# Altium schematic sheet PowerConnections.SchDoc
size A3; SheetNumber: 3; SheetTotal: 3
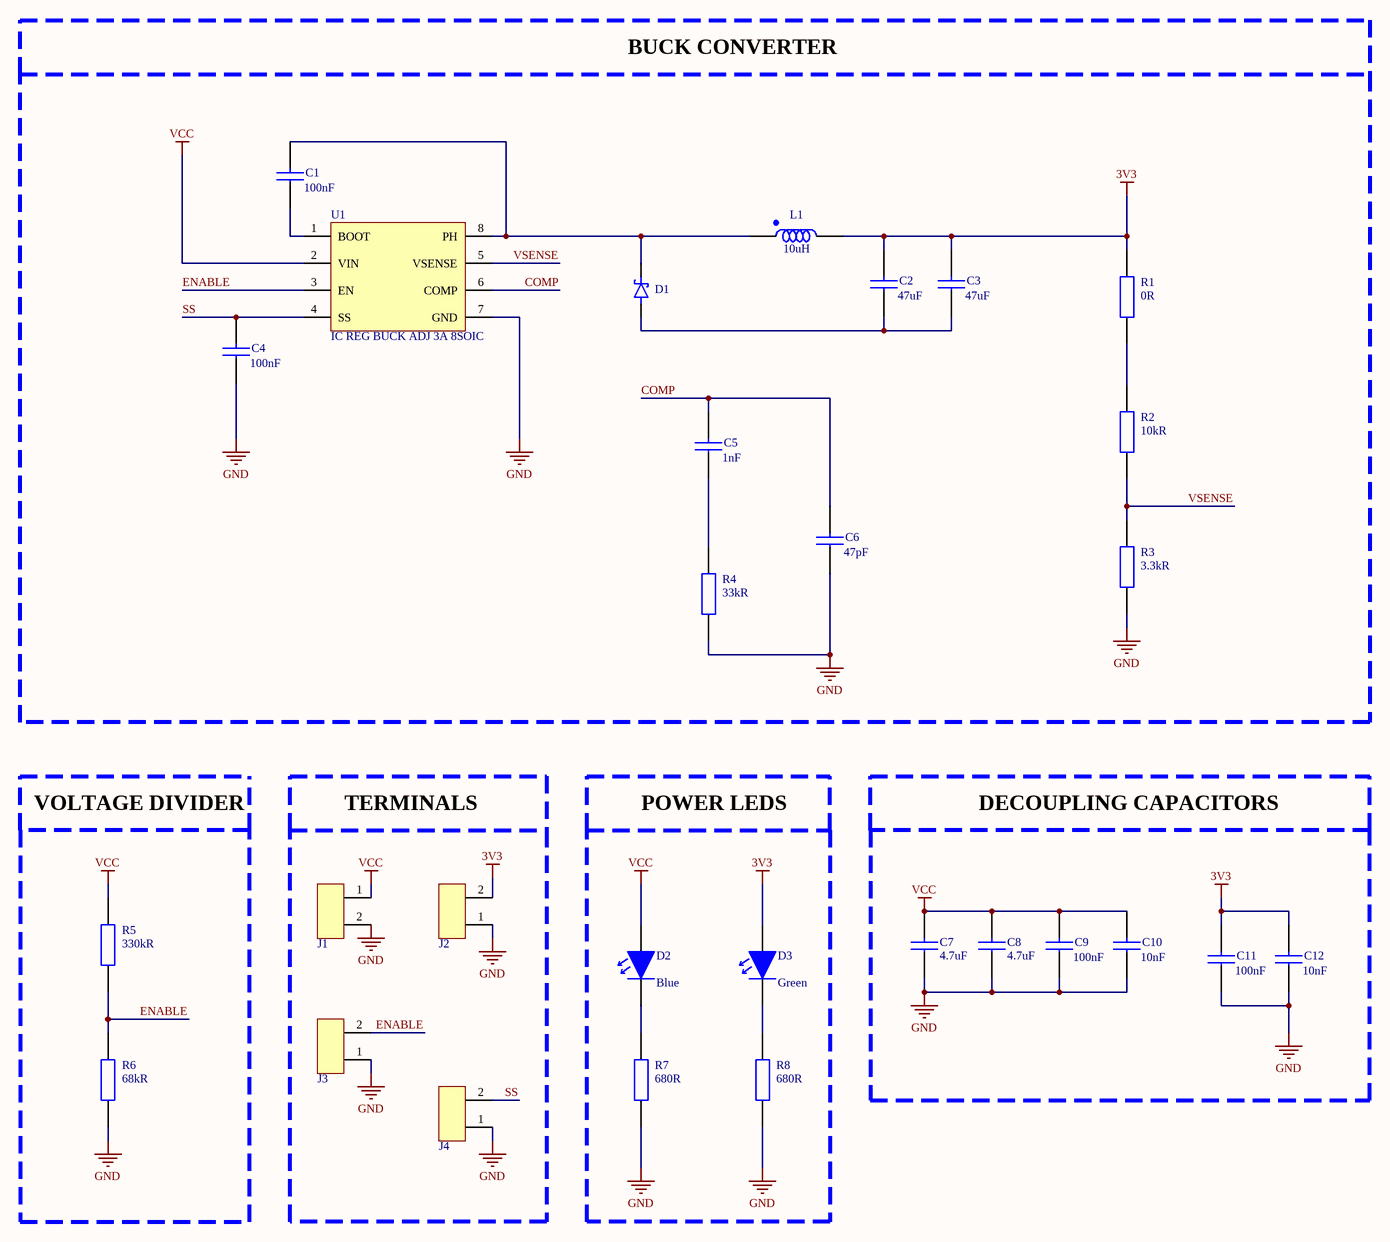
[diagram p0: PowerConnections.SchDoc]

## Parts
C1  Capacitance: 100nF  [CAP_1206]  (hidden comment: C1206C104J5RAC7800)
C2  Capacitance: 47uF  [CAP_1206]  (hidden comment: GMC31X5R476M25NT)
C3  Capacitance: 47uF  [CAP_1206]  (hidden comment: GMC31X5R476M25NT)
C4  Capacitance: 100nF  [CAP_1206]  (hidden comment: C1206C104J5RAC7800)
C5  Capacitance: 1nF  [CAP_1206]  (hidden comment: C3216C0G2J102J085AA)
C6  Capacitance: 47pF  [CAP_1206]  (hidden comment: C1206C470J5GAC7800)
C7  Capacitance: 4.7uF  [CAP_0805]  (hidden comment: CL21A475KAQNNNE)
C8  Capacitance: 4.7uF  [CAP_0805]  (hidden comment: CL21A475KAQNNNE)
C9  Capacitance: 100nF  [CAP_1206]  (hidden comment: C1206C104J5RAC7800)
C10  Capacitance: 10nF  [CAP_1206]  (hidden comment: C3216C0G2J103J160AA)
C11  Capacitance: 100nF  [CAP_1206]  (hidden comment: C1206C104J5RAC7800)
C12  Capacitance: 10nF  [CAP_1206]  (hidden comment: C3216C0G2J103J160AA)
D1  B340AE-13  [SMA]  (value not drawn)
D2  Color: Blue  [LED_BLUE_1206]  (hidden comment: 150120BS75000)
D3  Color: Green  [LED_GREEN_1206]  (hidden comment: 150120GS75000)
J1  282836-2  [TERMINAL]  (value not drawn)
J2  282836-2  [TERMINAL]  (value not drawn)
J3  2x1 Male Header 2.54mm  [2x1 Male Header 2.54mm]  (value not drawn)
J4  2x1 Male Header 2.54mm  [2x1 Male Header 2.54mm]  (value not drawn)
L1  Inductance: 10uH  [IND_1010]  (hidden comment: SRI1004)
R1  Resistance: 0R  [RES_1206]  (hidden comment: PMR18EZPJ000)
R2  Resistance: 10kR  [RES_1206]  (hidden comment: RC1206JR-0710KL)
R3  Resistance: 3.3kR  [RES_1206]  (hidden comment: RC1206JR-073K3L)
R4  Resistance: 33kR  [RES_1206]  (hidden comment: RES 33K OHM 5% 1/4W 1206)
R5  Resistance: 330kR  [RES_1206]  (hidden comment: RES 330K OHM 5% 1/4W 1206)
R6  Resistance: 68kR  [RES_1206]  (hidden comment: RES 68K OHM 5% 1/4W 1206)
R7  Resistance: 680R  [RES_1206]  (hidden comment: RC1206FR-07680RL)
R8  Resistance: 680R  [RES_1206]  (hidden comment: RC1206FR-07680RL)
U1  IC REG BUCK ADJ 3A 8SOIC  [SOIC8_PAD]

## Blocks framed on the sheet
BUCK CONVERTER: C1-C6 D1 L1 R1-R4 U1
VOLTAGE DIVIDER: R5 R6
TERMINALS: J1-J4
POWER LEDS: D2 D3 R7 R8
DECOUPLING CAPACITORS: C7-C12

## Nets
3V3: C2.2 C3.2 C11.2 C12.2 D3.2 J2.2 L1.2 R1.2
GND: C4.1 C6.1 C7.1 C8.1 C9.1 C10.1 C11.1 C12.1 J1.2 J2.1 J3.1 J4.1 R3.1 R4.1 R6.1 R7.1 R8.1 U1.7(GND)
VCC: C7.2 C8.2 C9.2 C10.2 D2.2 J1.1 R5.2 U1.2(VIN)
COMP: C5.2 C6.2 U1.6(COMP)
ENABLE: J3.2 R5.1 R6.2 U1.3(EN)
SS: C4.2 J4.2 U1.4(SS)
VSENSE: R2.1 R3.2 U1.5(VSENSE)
NetC1_1: C1.1 U1.1(BOOT)
NetC1_2: C1.2 D1.2 L1.1 U1.8(PH)
NetC2_1: C2.1 C3.1 D1.1
NetC5_1: C5.1 R4.2
NetD2_1: D2.1 R7.2
NetD3_1: D3.1 R8.2
NetR1_1: R1.1 R2.2

## Notes on the sheet
- DOSYA ADI / FILE NAME
- TANIM / DESCRIPTION
- HAZIRLAYAN / PREPARED BY
- YAYIN TARİHİ / REL. DATE
- BOYUT / SIZE
- SAYFA / SHEET
- /

## Library data of the parts
C1 C4 C9 C11 = CAP CER 100nF 1206: CAP CER 0.1UF 50V X7R 1206; Manufacturer: Kyocera AVX; Manufacturer Part Number: 12065C104JAT2A; Material: 4241ConductorMaterial; Tolerance: 5%; DesignedBy: Aslı Kurt; Supplier 1: Rs; RoHS: Yes; Category: Ceramic Capacitors; Stock 1: 8700; Pricing 1: 4000=0,049, 12000=0,048 (GBP); Mount: Surface Mount; Case/Package: 1206; Case Code (Imperial): 1206; Case Code (Metric): 3216; Weight: 0.000571oz; Min Operating Temperature: -55°C; Max Operating Temperature: 125°C; Voltage Rating: 50V; Packaging: Cut Tape; Package Quantity: 4000; Voltage Rating (DC): 50V; Dielectric: X7R; Termination: SMD/SMT; Series: -; Length: 3.2mm; Width: 1.6mm; Height: 0.5mm; RoHS Compliant: Yes; Lead Free: 5697LeadFree; ComponentLink1URL: https://datasheet.ciiva.com/26915/getdatasheetpartid-87553-26915356.pdf?src-supplier=Verical; ComponentLink1Description: https://datasheet.ciiva.com/26915/getdatasheetpartid-87553-26915356.pdf?src-supplier=Verical; ComponentLink2URL: https://datasheet.ciiva.com/27747/740463-27747550.pdf?src-supplier=Jameco; ComponentLink2Description: https://datasheet.ciiva.com/27747/740463-27747550.pdf?src-supplier=Jameco; ComponentLink3URL: https://datasheet.ciiva.com/7094/1818074-7094222.pdf?src-supplier=Newark; ComponentLink3Description: https://datasheet.ciiva.com/7094/1818074-7094222.pdf?src-supplier=Newark; ComponentLink4URL: https://datasheet.ciiva.com/11463/cx7r-11463226.pdf?src-supplier=Avnet; ComponentLink4Description: https://datasheet.ciiva.com/11463/cx7r-11463226.pdf?src-supplier=Avnet; ComponentLink5URL: https://datasheet.ciiva.com/16318/cx7r-16318250.pdf?src-supplier=Future+Electronics; ComponentLink5Description: https://datasheet.ciiva.com/16318/cx7r-16318250.pdf?src-supplier=Future+Electronics; ComponentLink6URL: https://datasheet.ciiva.com/11505/cx7r-11505336.pdf?src-supplier=Avnet; ComponentLink6Description: https://datasheet.ciiva.com/11505/cx7r-11505336.pdf?src-supplier=Avnet; ComponentLink7URL: https://datasheet.ciiva.com/7833/84526-7833657.pdf?src-supplier=Element14; ComponentLink7Description: https://datasheet.ciiva.com/7833/84526-7833657.pdf?src-supplier=Element14; ComponentLink8URL: https://datasheet.ciiva.com/8081/1679506-8081368.pdf?src-supplier=Element14; ComponentLink8Description: https://datasheet.ciiva.com/8081/1679506-8081368.pdf?src-supplier=Element14; ComponentLink9URL: https://datasheet.ciiva.com/7833/cx7r-7833399.pdf?src-supplier=Element14; ComponentLink9Description: https://datasheet.ciiva.com/7833/cx7r-7833399.pdf?src-supplier=Element14; ComponentLink10URL: https://datasheet.ciiva.com/152/cx7r-152041.pdf?src-supplier=Digikey; ComponentLink10Description: https://datasheet.ciiva.com/152/cx7r-152041.pdf?src-supplier=Digikey; ComponentLink11URL: https://datasheet.ciiva.com/152/cx7r-152040.pdf?src-supplier=Digikey; ComponentLink11Description: https://datasheet.ciiva.com/152/cx7r-152040.pdf?src-supplier=Digikey; ComponentLink12URL: https://datasheet.ciiva.com/152/cx7r-152042.pdf?src-supplier=Digikey; ComponentLink12Description: https://datasheet.ciiva.com/152/cx7r-152042.pdf?src-supplier=Digikey; ComponentLink13URL: https://datasheet.ciiva.com/14604/70001075-14604380.pdf?src-supplier=Allied+Electronics; ComponentLink13Description: https://datasheet.ciiva.com/14604/70001075-14604380.pdf?src-supplier=Allied+Electronics; Supplier 2: Avnet; Stock 2: 40000; Pricing 2: 4000=0,04296 (USD); Supplier 3: Future Electronics; Stock 3: 916000; Pricing 3: 4000=0,0373, 12000=0,0364, 20000=0,036, 60000=0,0351, 100000=0,0344 (USD); Supplier 4: Mouser; Stock 4: 79343; Pricing 4: 1=0,22, 10=0,105, 50=0,105, 100=0,066, 1000=0,062, 10000=0,041 (USD); Supplier Part Number 1: 1441626; Supplier Part Number 2: KGM31BR71H104JT; Supplier Part Number 3: 1247949; Supplier Part Number 4: 581-12065C104J
C2 C3 = CAP CER 47uF 1206: CAP CER 47UF 25V X5R 1206; Manufacturer: Cal-Chip Electronics; Tolerance: 20%; DesignedBy: Aslı Kurt; Supplier 1: Digikey; Manufacturer Part Number: GMC31X5R476M25NT; RoHS: Yes; Category: Ceramic Capacitors; Stock 1: 38887; Pricing 1: 1=0,99, 10=0,613, 50=0,4602, 100=0,4126, 500=0,33138, 1000=0,30602 (USD); Mount: Surface Mount; Case/Package: 1206; Min Operating Temperature: -55°C; Max Operating Temperature: 85°C; Series: GMC; Voltage Rating: 25V; ComponentLink1URL: http://www.calchipelectronics.com/pdf/gmc_series.pdf?src-supplier=Digikey; ComponentLink1Description: http://www.calchipelectronics.com/pdf/gmc_series.pdf?src-supplier=Digikey; Supplier 2: Digikey; Stock 2: 38887; Pricing 2: 1=0,99, 10=0,613, 50=0,4602, 100=0,4126, 500=0,33138, 1000=0,30602 (USD); Supplier 3: Digikey; Stock 3: 38000; Pricing 3: 2000=0,28788, 4000=0,27032, 6000=0,26149, 10000=0,25165, 14000=0,24588, 20000=0,24032 (USD); Supplier Part Number 1: 4713-GMC31X5R476M25NTCT-ND; Supplier Part Number 2: 4713-GMC31X5R476M25NTDKR-ND; Supplier Part Number 3: 4713-GMC31X5R476M25NTTR-ND
C5 = CAP CER 1nF 1206: Manufacturer: TDK; Material: 4241ConductorMaterial; DesignedBy: Aslı Kurt; Supplier 1: Mouser; Manufacturer Part Number: C3216C0G2J102J085AA; RoHS: Yes; Category: Ceramic Capacitors; Stock 1: 6821; Pricing 1: 1=0,26, 10=0,115, 50=0,115, 100=0,072, 1000=0,062, 10000=0,048 (USD); ComponentLink1URL: https://datasheet.ciiva.com/24219/c3216c0g2j102j085aa-265301-24219668.pdf?src-supplier=Mouser; ComponentLink1Description: https://datasheet.ciiva.com/24219/c3216c0g2j102j085aa-265301-24219668.pdf?src-supplier=Mouser; ComponentLink2URL: https://datasheet.ciiva.com/11788/0900766b80fc5cba-11788148.pdf?src-supplier=Rs; ComponentLink2Description: https://datasheet.ciiva.com/11788/0900766b80fc5cba-11788148.pdf?src-supplier=Rs; ComponentLink3URL: https://datasheet.ciiva.com/7726/1484596-7726604.pdf?src-supplier=Element14; ComponentLink3Description: https://datasheet.ciiva.com/7726/1484596-7726604.pdf?src-supplier=Element14; Supplier 2: Digikey; Stock 2: 72988; Pricing 2: 1=0,27, 10=0,154, 50=0,1098, 100=0,0961, 500=0,07266, 1000=0,06537 (USD); Supplier Part Number 2: 445-2342-1-ND; Supplier Part Number 1: 810-C3216C0G2J102J
C6 = CAP CER 47pF 1206: CAP CER 47PF 50V C0G/NP0 1206; Manufacturer: KEMET; Manufacturer Part Number: C1206C470J5GACTU; Dielectric Material: Ceramic; Material: 4241ConductorMaterial; Tolerance: 5%; Dielectric: C0G; Dissipation Factor: 0.1%; Temperature Coefficient: 30ppm/°C; Supplier 1: Mouser; RoHS: Yes; Category: Ceramic Capacitors; Stock 1: 9133; Pricing 1: 1=0,18, 10=0,089, 50=0,089, 100=0,051, 1000=0,035, 10000=0,026 (USD); Mount: Surface Mount,PCB; Case/Package: 1206; Case Code (Metric): 3216; Case Code (Imperial): 1206; Min Operating Temperature: -55°C; Max Operating Temperature: 125°C; Package Quantity: 1; Voltage Rating: 50V; Packaging: Tape and Reel; Voltage Rating (DC): 50V; Termination: SMD/SMT; Voltage: 50V; Series: C; Construction: Flat; Voltage Rating (AC): 50V; Length: 3.2mm; Width: 0.063inch; Height: 0.78mm; Depth: 1.6mm; Thickness: 0.035inch; Reach SVHC Compliant: No; RoHS Compliant: Yes; Lead Free: 5697LeadFree; ComponentLink1URL: https://datasheet.ciiva.com/7729/1691965-7729914.pdf?src-supplier=Element14; ComponentLink1Description: https://datasheet.ciiva.com/7729/1691965-7729914.pdf?src-supplier=Element14; ComponentLink2URL: https://datasheet.ciiva.com/7729/1691965-7729913.pdf?src-supplier=Element14; ComponentLink2Description: https://datasheet.ciiva.com/7729/1691965-7729913.pdf?src-supplier=Element14; ComponentLink3URL: https://datasheet.ciiva.com/28668/1789732-28668879.pdf?src-supplier=Element14; ComponentLink3Description: https://datasheet.ciiva.com/28668/1789732-28668879.pdf?src-supplier=Element14; ComponentLink4URL: https://datasheet.ciiva.com/14598/70095383-14598902.pdf?src-supplier=Allied+Electronics; ComponentLink4Description: https://datasheet.ciiva.com/14598/70095383-14598902.pdf?src-supplier=Allied+Electronics; ComponentLink5URL: https://datasheet.ciiva.com/14598/70095383-14598719.pdf?src-supplier=Allied+Electronics; ComponentLink5Description: https://datasheet.ciiva.com/14598/70095383-14598719.pdf?src-supplier=Allied+Electronics; ComponentLink6URL: https://datasheet.ciiva.com/11463/kem-c1003-c0g-smd-11463659.pdf?src-supplier=Avnet; ComponentLink6Description: https://datasheet.ciiva.com/11463/kem-c1003-c0g-smd-11463659.pdf?src-supplier=Avnet; ComponentLink7URL: https://datasheet.ciiva.com/2988/kem-c1003-c0g-smd-2988767.pdf?src-supplier=Avnet; ComponentLink7Description: https://datasheet.ciiva.com/2988/kem-c1003-c0g-smd-2988767.pdf?src-supplier=Avnet; Supplier 2: Rs; Stock 2: 8000; Pricing 2: 500=0,022, 1000=0,019, 1500=0,017 (GBP); Supplier 3: Arrow Electronics; Stock 3: 12000; Pricing 3: 4000=0,0232, 8000=0,021, 24000=0,02 (USD); Supplier 4: Digikey; Stock 4: 41465; Pricing 4: 1=0,2, 10=0,112, 50=0,0788, 100=0,0685, 500=0,05114, 1000=0,04574 (USD); Supplier Part Number 1: 80-C1206C470J5GACTU; Supplier Part Number 4: 399-C1206C470J5GAC7800CT-ND; Supplier Part Number 3: C1206C470J5GACTU; Supplier Part Number 2: 8029999
C7 C8 = CAP CER 4.7uF 0805: CAP CER 4.7uF %10 0805; Manufacturer: Samsung; Tolerance: 10%; Voltage Rating: 25V; Dielectric: X5R; Designed by: BERK; Supplier 1: Digi-Key; Manufacturer Part Number: CL21A475KAQNNNE; RoHS: Yes; Category: Ceramic Capacitors; Stock 1: 1477018; Pricing 1: 1=0,11000, 10=0,08100, 50=0,04580, 100=0,03800, 500=0,02664, 1000=0,02205 (USD); Mount: Surface Mount; Case/Package: 0805; Case Code (Metric): 2012; Case Code (Imperial): 0805; Min Operating Temperature: -55°C; Max Operating Temperature: 85°C; Package Quantity: 1; Packaging: Tape and Reel; Voltage Rating (DC): 25V; Series: CL; Construction: Flat; Length: 2mm; Width: 0.049inch; Height: 1.25mm; Thickness: 0.055inch; Depth: 1.25mm; Radiation Hardening: No; Lead Free: Lead Free; RoHS Compliant: Yes; ComponentLink1URL: https://datasheet.ciiva.com/25798/cl21a475kaqnnne-25798882.pdf?src-supplier=Digi-Key; ComponentLink1Description: https://datasheet.ciiva.com/25798/cl21a475kaqnnne-25798882.pdf?src-supplier=Digi-Key; Supplier Part Number 1: 1276-1244-1-ND
C10 C12 = CAP CER 10nF 1206: Manufacturer: TDK; Material: 4241ConductorMaterial; Temperature Coefficient: 30ppm/°C; DesignedBy: Aslı Kurt; Supplier 1: Rs; Manufacturer Part Number: C3216C0G2J103J160AA; RoHS: Yes; Category: Ceramic Capacitors; Stock 1: 9940; Pricing 1: 2000=0,092, 6000=0,095 (GBP); Lead Free: 5697LeadFree; ComponentLink1URL: http://www.mouser.com/ds/2/400/lcc_commercial_highvoltage_en-520036.pdf?src-supplier=Mouser; ComponentLink1Description: http://www.mouser.com/ds/2/400/lcc_commercial_highvoltage_en-520036.pdf?src-supplier=Mouser; ComponentLink2URL: https://datasheet.octopart.com/C3216C0G2J103J160AA-TDK-datasheet-43914167.pdf?src-supplier=Newark; ComponentLink2Description: https://datasheet.octopart.com/C3216C0G2J103J160AA-TDK-datasheet-43914167.pdf?src-supplier=Newark; ComponentLink3URL: https://product.tdk.com/info/en/documents/chara_sheet/C3216C0G2J103J160AA.pdf?src-supplier=Digikey; ComponentLink3Description: https://product.tdk.com/info/en/documents/chara_sheet/C3216C0G2J103J160AA.pdf?src-supplier=Digikey; ComponentLink4URL: https://product.tdk.com/info/en/catalog/spec/mlccspec_commercial_general_midvoltage_en.pdf?src-supplier=Digikey; ComponentLink4Description: https://product.tdk.com/info/en/catalog/spec/mlccspec_commercial_general_midvoltage_en.pdf?src-supplier=Digikey; ComponentLink5URL: http://product.tdk.com/en/catalog/datasheets/mlcc_commercial_midvoltage_en.pdf?src-supplier=Avnet; ComponentLink5Description: http://product.tdk.com/en/catalog/datasheets/mlcc_commercial_midvoltage_en.pdf?src-supplier=Avnet; ComponentLink6URL: https://datasheet.octopart.com/C3216C0G2J103J160AA-TDK-datasheet-41194876.pdf?src-supplier=Future+Electronics; ComponentLink6Description: https://datasheet.octopart.com/C3216C0G2J103J160AA-TDK-datasheet-41194876.pdf?src-supplier=Future+Electronics; Supplier 2: Digikey; Stock 2: 35379; Pricing 2: 1=0,53, 10=0,316, 50=0,231, 100=0,2046, 500=0,1596, 1000=0,14555 (USD); Supplier Part Number 1: 1795135; Supplier 3: Arrow Electronics; Stock 3: 264; Pricing 3: 264=0,1004 (USD); Supplier 4: Future Electronics; Stock 4: 1420; Pricing 4: 1=0,405, 15=0,32, 50=0,285, 250=0,235, 1000=0,195 (USD); Supplier Part Number 4: 6103616; Supplier Part Number 3: C3216C0G2J103J160AA; Supplier Part Number 2: 445-14625-1-ND
D1 = B340A: Rectifier Diode Schottky 40V 3A 2-Pin SMA T/R; Manufacturer: Diodes; DesignedBy: Aslı Kurt; Supplier 1: Digikey; Manufacturer Part Number: B340AE-13; RoHS: Yes; Category: Schottky Diodes; Stock 1: 232201; Pricing 1: 1=0,37, 10=0,248, 100=0,1671, 500=0,1296, 1000=0,1171, 2000=0,10643 (USD); Forward Current: 3A; ComponentLink1URL: https://www.diodes.com/assets/Datasheets/B320AE-B345AE.pdf?src-supplier=Digikey; ComponentLink1Description: https://www.diodes.com/assets/Datasheets/B320AE-B345AE.pdf?src-supplier=Digikey; Supplier Part Number 1: B340AE-13DICT-ND; Supplier 2: Digikey; Stock 2: 232201; Pricing 2: 1=0,37, 10=0,248, 100=0,1671, 500=0,1296, 1000=0,1171, 2000=0,10643 (USD); Supplier Part Number 2: B340AE-13DIDKR-ND
D2 = LED BLUE 1206: Led, Blue, 470 Nm, 3.2 V, 30 Ma, 145 Mcd Rohs Compliant: Yes |Wurth Elektronik 150120BS75000; Manufacturer: Wurth Electronics; Lens Color: Colorless; Luminous Intensity: 145mcd; Viewing Angle: 140°; Forward Voltage: 3.2V; Wavelength: 470nm; Forward Current: 30mA; Lens Style: Clear,Flat,Rectangular; Test Current: 20mA; Lens Transparency: Clear; Lens Size: 1.6mm; DesignedBy: Aslı Kurt; Supplier 1: Rs; Manufacturer Part Number: 150120BS75000; RoHS: Yes; Category: LEDs; Stock 1: 2200; Pricing 1: 500=0,119, 750=0,113, 1500=0,11, 3000=0,104 (GBP); Mount: Surface Mount; Case/Package: 1206; Case Code (Metric): 3216; Case Code (Imperial): 1206; Min Operating Temperature: -40°C; Max Operating Temperature: 85°C; Package Quantity: 1; Packaging: Cut Tape; Dominant Wavelength: 470nm; Series: WL-SMCW; Length: 3.2mm; Width: 1.6mm; Height: 0.69mm; RoHS Compliant: Yes; Reach SVHC Compliant: Unknown; ComponentLink1URL: https://datasheet.ciiva.com/22656/150120bs75000-22656976.pdf?src-supplier=Element14; ComponentLink1Description: https://datasheet.ciiva.com/22656/150120bs75000-22656976.pdf?src-supplier=Element14; ComponentLink2URL: https://datasheet.ciiva.com/29279/759440-da-01-en-chipled-1206-w-kl-blau-150120bs75000-29279045.pdf?src-supplier=Conrad; ComponentLink2Description: https://datasheet.ciiva.com/29279/759440-da-01-en-chipled-1206-w-kl-blau-150120bs75000-29279045.pdf?src-supplier=Conrad; ComponentLink3URL: https://datasheet.ciiva.com/29561/150120bs75000-29561882.pdf?src-supplier=Digikey; ComponentLink3Description: https://datasheet.ciiva.com/29561/150120bs75000-29561882.pdf?src-supplier=Digikey; Supplier 2: Farnell; Stock 2: 4482; Pricing 2: 5=0,251, 10=0,213, 100=0,172, 500=0,156, 1000=0,153 (EUR); Supplier 3: Digikey; Stock 3: 25240; Pricing 3: 1=0,22, 50=0,211, 100=0,182, 500=0,158 (USD); Supplier 4: Mouser; Stock 4: 4085; Pricing 4: 1=0,23, 10=0,225, 50=0,211, 100=0,182, 1000=0,165, 10000=0,165 (USD); Supplier Part Number 1: 8154243P; Supplier Part Number 2: 2322084; Supplier Part Number 3: 732-4989-1-ND; Supplier Part Number 4: 710-150120BS75000
D3 = LED GREEN 1206: WL-SMCW SMT Mono-Color Chip LED Waterclear; Manufacturer: Wurth Electronics; Lens Color: Colorless; Wavelength: 520nm; Luminous Intensity: 450mcd; Viewing Angle: 140°; Forward Voltage: 3.2V; Forward Current: 30mA; Lens Style: Clear,Flat,Rectangular; Test Current: 20mA; Lens Transparency: Clear; Max Reverse Voltage (DC): 5V; Power Dissipation: 105mW; Lens Size: 1.6mm; DesignedBy: Aslı Kurt; Supplier 1: Rs; Manufacturer Part Number: 150120GS75000; RoHS: Yes; Category: LEDs; Stock 1: 4450; Pricing 1: 500=0,119, 750=0,113, 1500=0,11, 3000=0,104 (GBP); Mount: Surface Mount; Case/Package: 1206; Case Code (Metric): 3216; Case Code (Imperial): 1206; Min Operating Temperature: -40°C; Max Operating Temperature: 85°C; Package Quantity: 1; Packaging: Cut Tape; Dominant Wavelength: 520nm; Series: WL-SMCW; Reverse Voltage: 5V; Length: 3.2mm; Width: 1.6mm; Height: 0.69mm; RoHS Compliant: Yes; Reach SVHC Compliant: Unknown; ComponentLink1URL: https://datasheet.ciiva.com/22656/150120gs75000-22656979.pdf?src-supplier=Element14; ComponentLink1Description: https://datasheet.ciiva.com/22656/150120gs75000-22656979.pdf?src-supplier=Element14; ComponentLink2URL: https://datasheet.ciiva.com/29279/759441-da-01-en-chipled-1206-w-kl-gruen-150120gs75000-29279042.pdf?src-supplier=Conrad; ComponentLink2Description: https://datasheet.ciiva.com/29279/759441-da-01-en-chipled-1206-w-kl-gruen-150120gs75000-29279042.pdf?src-supplier=Conrad; ComponentLink3URL: https://datasheet.ciiva.com/48430/150120gs75000-eng-tds-48430053.pdf?src-supplier=Distrelec; ComponentLink3Description: https://datasheet.ciiva.com/48430/150120gs75000-eng-tds-48430053.pdf?src-supplier=Distrelec; ComponentLink4URL: https://datasheet.ciiva.com/29561/150120gs75000-29561884.pdf?src-supplier=Digikey; ComponentLink4Description: https://datasheet.ciiva.com/29561/150120gs75000-29561884.pdf?src-supplier=Digikey; ComponentLink5URL: https://datasheet.ciiva.com/29561/150120gs75000-29561883.pdf?src-supplier=Digikey; ComponentLink5Description: https://datasheet.ciiva.com/29561/150120gs75000-29561883.pdf?src-supplier=Digikey; ComponentLink6URL: https://datasheet.ciiva.com/29561/150120gs75000-29561885.pdf?src-supplier=Digikey; ComponentLink6Description: https://datasheet.ciiva.com/29561/150120gs75000-29561885.pdf?src-supplier=Digikey; Supplier 2: Farnell; Stock 2: 6145; Pricing 2: 100=0,172, 500=0,156, 1000=0,153 (EUR); Supplier 3: Mouser; Stock 3: 4986; Pricing 3: 1=0,23, 10=0,225, 50=0,211, 100=0,182, 1000=0,165, 10000=0,165 (USD); Supplier 4: Digikey; Stock 4: 22547; Pricing 4: 1=0,22, 50=0,211, 100=0,182, 500=0,158 (USD); Supplier Part Number 1: 8154247P; Supplier Part Number 2: 2322085RL; Supplier Part Number 3: 710-150120GS75000; Supplier Part Number 4: 732-4990-1-ND
J1 J2 = 2x1 TERMINAL 5mm: Connector, Terminal Block; Wire Receptacle; 2 Pos.; 16-30 AWG; 0.197 in. CL; Sid; Manufacturer: TE Connectivity; Designed By: Aslı Kurt; Plating: Brass; Number of Positions: 2; Number of Levels: 1; Current: 13.5A; Voltage: 300V; Interlock: Yes (With); Screw Flange: No (Without); Connector System: 5937ConnectorSystem; Voltage Rating (DC): 250V; Pitch: 5mm; Wire Gauge (Max): 30AWG; Thread Size: M3; Tail Length: 3.5mm; Approvals: UL; Supplier 1: Digikey; Manufacturer Part Number: 282836-2; RoHS: Yes; Category: Terminal Blocks; Stock 1: 33835; Pricing 1: 1=0,6, 10=0,578, 25=0,576, 50=0,5566, 100=0,4666, 300=0,43743, 600=0,41315, 1200=0,36211, 5100=0,31593 (USD); Mount: Through Hole; Color: Green; Contact Material: Brass; Housing Color: Green; Contact Plating: Tin; Housing Material: Polyamide; Insulation Material: Nylon; Min Operating Temperature: -40°C; Max Operating Temperature: 105°C; Number of Rows: 1; Termination: Solder; Series: Buchanan; Packaging: Tray; Package Quantity: 300; Number of Positions Per Level: 2; Number of Contacts: 2; Orientation: Straight; Current Rating: 13.5A; Number of Circuits: 2; Screwless Terminal Block: No (Without); Side Stackable: Yes (With); Operating Supply Voltage: 300V; Voltage Rating: 300V; Max Voltage Rating (AC): 300V; Number of Poles: 2; Max Supply Voltage (AC): 300V; Connector Type: Receptacle; Closed End: No (Without); Max Current Rating: 13.5A; Length: 10.6mm; Width: 10mm; Wire Gauge (Min): 30AWG; Wire/Cable Gauge: 30AWG; Depth: 8.2mm; Radiation Hardening: No; Flammability Rating: UL94 V-0; RoHS Compliant: Yes; ELV: Compliant; Lead Free: Lead Free; Reach SVHC Compliant: Unknown; ComponentLink1URL: https://datasheet.ciiva.com/7628/1731782-7628513.pdf?src-supplier=Element14; ComponentLink1Description: https://datasheet.ciiva.com/7628/1731782-7628513.pdf?src-supplier=Element14; ComponentLink2URL: https://datasheet.ciiva.com/16393/282836-2-16393382.pdf?src-supplier=Future+Electronics; ComponentLink2Description: https://datasheet.ciiva.com/16393/282836-2-16393382.pdf?src-supplier=Future+Electronics; ComponentLink3URL: https://datasheet.ciiva.com/15169/getdatasheetpartid-155855-15169553.pdf?src-supplier=Verical; ComponentLink3Description: https://datasheet.ciiva.com/15169/getdatasheetpartid-155855-15169553.pdf?src-supplier=Verical; ComponentLink4URL: https://datasheet.ciiva.com/11757/0900766b8002dc8a-11757385.pdf?src-supplier=Rs; ComponentLink4Description: https://datasheet.ciiva.com/11757/0900766b8002dc8a-11757385.pdf?src-supplier=Rs; ComponentLink5URL: https://datasheet.ciiva.com/823/eng-cd-282836-h10-823437.pdf?src-supplier=Digikey; ComponentLink5Description: https://datasheet.ciiva.com/823/eng-cd-282836-h10-823437.pdf?src-supplier=Digikey; ComponentLink6URL: https://datasheet.ciiva.com/3141/eng-cs-1308389-eurostyle-terminal-blocks-0607-3141118.pdf?src-supplier=Avnet; ComponentLink6Description: https://datasheet.ciiva.com/3141/eng-cs-1308389-eurostyle-terminal-blocks-0607-3141118.pdf?src-supplier=Avnet; ComponentLink7URL: https://datasheet.ciiva.com/30261/eng-cs-1308389-eurostyle-terminal-blocks-0607-30261813.pdf?src-supplier=Onlinecomponents.com; ComponentLink7Description: https://datasheet.ciiva.com/30261/eng-cs-1308389-eurostyle-terminal-blocks-0607-30261813.pdf?src-supplier=Onlinecomponents.com; Supplier Part Number 1: A98076-ND
L1 = IND 10uH: 10uH 10X10 4.8A - SMD Güç Bobini - SRI1004; DesignedBy: Aslı Kurt; Producer: CoreMaster; Tolerance: 20%; ComponentLink1Description: Direncnet; ComponentLink1URL: https://www.direnc.net/10uh-10x10-48a-smd-guc-bobini-sri1004; ComponentLink2Description: Datasheet; ComponentLink2URL: https://pdf.direnc.net/upload/10uh-10x10-4-8a-smd-guc-bobini-sri1004-datasheet.pdf; Current: 4.8A
R1 = RES 0 OHM 1206: Res Thick Film 1206 0 Ohm 5% Molded SMD Paper T/R; Manufacturer: Rohm; Max Current Rating: 38.7A; Temperature Coefficient: 100ppm/°C; DesignedBy: Aslı Kurt; Supplier 1: Future Electronics; Manufacturer Part Number: PMR18EZPJ000; RoHS: Yes; Category: Chip SMD Resistors; Stock 1: 10000; Pricing 1: 5000=0,154, 10000=0,151, 15000=0,149, 20000=0,148, 25000=0,144 (USD); Case/Package: 340Case; Min Operating Temperature: -55°C; Max Operating Temperature: 155°C; Height: 420um; ComponentLink1URL: https://datasheet.octopart.com/PMR18EZPJ000-Rohm-datasheet-115132289.pdf?src-supplier=Future+Electronics; ComponentLink1Description: https://datasheet.octopart.com/PMR18EZPJ000-Rohm-datasheet-115132289.pdf?src-supplier=Future+Electronics; Supplier 2: Digikey; Stock 2: 20524; Pricing 2: 1=0,94, 10=0,539, 25=0,438, 50=0,3766, 100=0,3254, 250=0,27044, 500=0,23676, 1000=0,20858 (USD); Supplier Part Number 2: 846-PMR18EZPJ000CT-ND; Supplier Part Number 1: 3099053
R2 = RES 10K OHM 1206: RES 10K OHM 5% 1/4W 1206; Manufacturer: Yageo; Temperature Coefficient: 100ppm/°C; Power Rating: 250mW; Voltage Rating: 200V; DesignedBy: Aslı Kurt; Supplier 1: Future Electronics; Manufacturer Part Number: RC1206JR-0710KL; RoHS: Yes; Category: Chip SMD Resistors; Stock 1: 145000; Pricing 1: 5000=0,0034, 20000=0,0033, 75000=0,0031, 200000=0,003, 500000=0,0029 (USD); Case/Package: 1206; Case Code (Imperial): 1206; Case Code (Metric): 3216; Min Operating Temperature: -55°C; Max Operating Temperature: 155°C; Resistor Type: Thick Film; Tolerance: 5%; Packaging: Cut Tape; Package Quantity: 1; Termination: SMD/SMT; Number of Terminations: 2; Max Power Dissipation: 250mW; Series: RC1206; Resistance Tolerance: 5%; Voltage Rating (AC): 200V; Length: 0.122inch; Width: 0.063inch; Height: 0.026inch; Lead Free: Lead Free; RoHS Compliant: Yes; Reach SVHC Compliant: Unknown; ComponentLink1URL: https://datasheet.ciiva.com/29154/402664-da-01-en-smd-widerstand-chip1206-10-kohm-29154546.pdf?src-supplier=Conrad; ComponentLink1Description: https://datasheet.ciiva.com/29154/402664-da-01-en-smd-widerstand-chip1206-10-kohm-29154546.pdf?src-supplier=Conrad; ComponentLink2URL: https://datasheet.ciiva.com/7983/444357-7983813.pdf?src-supplier=Element14; ComponentLink2Description: https://datasheet.ciiva.com/7983/444357-7983813.pdf?src-supplier=Element14; ComponentLink3URL: https://datasheet.ciiva.com/2458/pyu-rc1206-51-rohs-l-4-2458636.pdf?src-supplier=Digikey; ComponentLink3Description: https://datasheet.ciiva.com/2458/pyu-rc1206-51-rohs-l-4-2458636.pdf?src-supplier=Digikey; ComponentLink4URL: https://datasheet.ciiva.com/2458/pyu-rc1206-51-rohs-l-4-2458637.pdf?src-supplier=Digikey; ComponentLink4Description: https://datasheet.ciiva.com/2458/pyu-rc1206-51-rohs-l-4-2458637.pdf?src-supplier=Digikey; ComponentLink5URL: https://datasheet.ciiva.com/2458/pyu-rc1206-51-rohs-l-4-2458635.pdf?src-supplier=Digikey; ComponentLink5Description: https://datasheet.ciiva.com/2458/pyu-rc1206-51-rohs-l-4-2458635.pdf?src-supplier=Digikey; Supplier 2: Digikey; Stock 2: 179700; Pricing 2: 1=0,1, 10=0,024, 50=0,022, 100=0,0194, 500=0,01224, 1000=0,0102 (USD); Supplier Part Number 1: 4750733; Supplier Part Number 2: 311-10KERCT-ND
R3 = RES 3K3 OHM 1206: RES 3.3K OHM 5% 1/4W 1206; Manufacturer: Yageo; DesignedBy: Aslı Kurt; Supplier 1: Farnell; Manufacturer Part Number: RC1206JR-073K3L; RoHS: Yes; Category: Chip SMD Resistors; Stock 1: 157764; Pricing 1: 10=0,0172, 100=0,0107, 500=0,0094, 1000=0,0081, 2500=0,0059, 5000=0,0037, 25000=0,0036, 50000=0,0035 (EUR); Lead Free: 5697LeadFree; ComponentLink1URL: https://datasheet.ciiva.com/29181/402605-da-01-en-smd-widerstand-chip1206-3-3-kohm-29181477.pdf?src-supplier=Conrad; ComponentLink1Description: https://datasheet.ciiva.com/29181/402605-da-01-en-smd-widerstand-chip1206-3-3-kohm-29181477.pdf?src-supplier=Conrad; ComponentLink2URL: https://datasheet.ciiva.com/2458/pyu-r-int-thick-7-2458662.pdf?src-supplier=Digikey; ComponentLink2Description: https://datasheet.ciiva.com/2458/pyu-r-int-thick-7-2458662.pdf?src-supplier=Digikey; ComponentLink3URL: https://datasheet.ciiva.com/2458/pyu-r-int-thick-7-2458663.pdf?src-supplier=Digikey; ComponentLink3Description: https://datasheet.ciiva.com/2458/pyu-r-int-thick-7-2458663.pdf?src-supplier=Digikey; ComponentLink4URL: https://datasheet.ciiva.com/2458/pyu-r-int-thick-7-2458664.pdf?src-supplier=Digikey; ComponentLink4Description: https://datasheet.ciiva.com/2458/pyu-r-int-thick-7-2458664.pdf?src-supplier=Digikey; ComponentLink5URL: https://datasheet.ciiva.com/7857/444357-7857499.pdf?src-supplier=Element14; ComponentLink5Description: https://datasheet.ciiva.com/7857/444357-7857499.pdf?src-supplier=Element14; ComponentLink6URL: https://datasheet.ciiva.com/7857/444357-7857500.pdf?src-supplier=Element14; ComponentLink6Description: https://datasheet.ciiva.com/7857/444357-7857500.pdf?src-supplier=Element14; Supplier 2: Digikey; Stock 2: 317191; Pricing 2: 1=0,1, 10=0,025, 50=0,0158, 100=0,0133, 500=0,0092, 1000=0,00796 (USD); Supplier Part Number 1: 9240586; Supplier Part Number 2: 311-3.3KERCT-ND
R4 = RES 33K OHM 1206: SMD Chip Resistor, 33 kOhm, ï¿½ 5%, 250 mW, 1206 [3216 Metric], Thick Film, General Purpose; Manufacturer: Yageo; Manufacturer Part Number: RC1206JR-0733KL; Voltage Rating (AC): 200V; DesignedBy: Aslı Kurt; Supplier 1: Digikey; RoHS: Yes; Category: Chip SMD Resistors; Stock 1: 425111; Pricing 1: 1=0,1, 10=0,023, 50=0,0184, 100=0,0133, 500=0,01122, 1000=0,00918 (USD); Lead Free: 5697LeadFree; ComponentLink1URL: https://datasheet.ciiva.com/29181/402729-da-01-en-smd-widerstand-chip1206-33-kohm-29181369.pdf?src-supplier=Conrad; ComponentLink1Description: https://datasheet.ciiva.com/29181/402729-da-01-en-smd-widerstand-chip1206-33-kohm-29181369.pdf?src-supplier=Conrad; ComponentLink2URL: https://datasheet.ciiva.com/7857/444357-7857487.pdf?src-supplier=Element14; ComponentLink2Description: https://datasheet.ciiva.com/7857/444357-7857487.pdf?src-supplier=Element14; ComponentLink3URL: https://datasheet.ciiva.com/16747/pyu-rc1206-51-rohs-l-4-16747052.pdf?src-supplier=Future+Electronics; ComponentLink3Description: https://datasheet.ciiva.com/16747/pyu-rc1206-51-rohs-l-4-16747052.pdf?src-supplier=Future+Electronics; Supplier 2: Future Electronics; Stock 2: 75000; Pricing 2: 5000=0,0036, 20000=0,0035, 75000=0,0033, 200000=0,0032, 500000=0,0031 (USD); Supplier Part Number 2: 1124239; Supplier Part Number 1: 311-33KERCT-ND
R5 = RES 330K OHM 1206: Manufacturer: Yageo; Manufacturer Part Number: RC1206JR-07330KL; DesignedBy: Aslı Kurt; Supplier 1: Digikey; RoHS: Yes; Category: Chip SMD Resistors; Stock 1: 93095; Pricing 1: 1=0,1, 10=0,023, 50=0,0188, 100=0,0143, 500=0,01274, 1000=0,01122 (USD); ComponentLink1URL: https://datasheet.ciiva.com/29181/402842-da-01-en-smd-widerstand-chip1206-330-kohm-29181410.pdf?src-supplier=Conrad; ComponentLink1Description: https://datasheet.ciiva.com/29181/402842-da-01-en-smd-widerstand-chip1206-330-kohm-29181410.pdf?src-supplier=Conrad; ComponentLink2URL: https://datasheet.ciiva.com/2520/pyu-r-int-thick-7-2520647.pdf?src-supplier=Digikey; ComponentLink2Description: https://datasheet.ciiva.com/2520/pyu-r-int-thick-7-2520647.pdf?src-supplier=Digikey; ComponentLink3URL: https://datasheet.ciiva.com/2520/pyu-r-int-thick-7-2520648.pdf?src-supplier=Digikey; ComponentLink3Description: https://datasheet.ciiva.com/2520/pyu-r-int-thick-7-2520648.pdf?src-supplier=Digikey; ComponentLink4URL: https://datasheet.ciiva.com/2520/pyu-r-int-thick-7-2520649.pdf?src-supplier=Digikey; ComponentLink4Description: https://datasheet.ciiva.com/2520/pyu-r-int-thick-7-2520649.pdf?src-supplier=Digikey; ComponentLink5URL: https://datasheet.ciiva.com/7857/444357-7857483.pdf?src-supplier=Element14; ComponentLink5Description: https://datasheet.ciiva.com/7857/444357-7857483.pdf?src-supplier=Element14; ComponentLink6URL: https://datasheet.ciiva.com/7857/444357-7857484.pdf?src-supplier=Element14; ComponentLink6Description: https://datasheet.ciiva.com/7857/444357-7857484.pdf?src-supplier=Element14; ComponentLink7URL: https://datasheet.ciiva.com/28639/1675737-28639914.pdf?src-supplier=Element14; ComponentLink7Description: https://datasheet.ciiva.com/28639/1675737-28639914.pdf?src-supplier=Element14; ComponentLink8URL: https://datasheet.ciiva.com/17422/pyu-rc1206-51-rohs-l-4-17422334.pdf?src-supplier=Future+Electronics; ComponentLink8Description: https://datasheet.ciiva.com/17422/pyu-rc1206-51-rohs-l-4-17422334.pdf?src-supplier=Future+Electronics; Supplier Part Number 1: 311-330KERCT-ND
R6 = RES 68K OHM 1206: Manufacturer: Yageo; Manufacturer Part Number: RC1206JR-0768KL; Voltage Rating (AC): 200V; DesignedBy: Aslı Kurt; Supplier 1: Digikey; RoHS: Yes; Category: Chip SMD Resistors; Stock 1: 105931; Pricing 1: 1=0,1, 10=0,022, 50=0,0188, 100=0,0153, 500=0,01122, 1000=0,00918 (USD); Lead Free: 5697LeadFree; ComponentLink1URL: https://datasheet.ciiva.com/7857/444357-7857527.pdf?src-supplier=Element14; ComponentLink1Description: https://datasheet.ciiva.com/7857/444357-7857527.pdf?src-supplier=Element14; ComponentLink2URL: https://datasheet.ciiva.com/7857/444357-7857528.pdf?src-supplier=Element14; ComponentLink2Description: https://datasheet.ciiva.com/7857/444357-7857528.pdf?src-supplier=Element14; Supplier Part Number 1: 311-68KERCT-ND; Supplier 2: Digikey; Stock 2: 105931; Pricing 2: 1=0,1, 10=0,022, 50=0,0188, 100=0,0153, 500=0,01122, 1000=0,00918 (USD); Supplier Part Number 2: 311-68KERDKR-ND
R7 R8 = RES 680 OHM 1206: SMD Chip Resistor, 680 Ohm, ï¿½ 1%, 250 mW, 1206 [3216 Metric], Thick Film, General Purpose; Manufacturer: Yageo; Voltage Rating (AC): 200V; DesignedBy: Aslı Kurt; Supplier 1: Future Electronics; Manufacturer Part Number: RC1206FR-07680RL; RoHS: Yes; Category: Chip SMD Resistors; Stock 1: 315000; Pricing 1: 5000=0,0057, 20000=0,0055, 75000=0,0052, 200000=0,0051, 500000=0,0049 (USD); Lead Free: 5697LeadFree; ComponentLink1URL: https://datasheet.ciiva.com/11819/0900766b80c6630a-11819964.pdf?src-supplier=Rs; ComponentLink1Description: https://datasheet.ciiva.com/11819/0900766b80c6630a-11819964.pdf?src-supplier=Rs; ComponentLink2URL: https://datasheet.ciiva.com/7857/444357-7857386.pdf?src-supplier=Element14; ComponentLink2Description: https://datasheet.ciiva.com/7857/444357-7857386.pdf?src-supplier=Element14; ComponentLink3URL: https://datasheet.ciiva.com/7857/1686128-7857387.pdf?src-supplier=Element14; ComponentLink3Description: https://datasheet.ciiva.com/7857/1686128-7857387.pdf?src-supplier=Element14; ComponentLink4URL: https://datasheet.ciiva.com/7857/444357-7857388.pdf?src-supplier=Element14; ComponentLink4Description: https://datasheet.ciiva.com/7857/444357-7857388.pdf?src-supplier=Element14; ComponentLink5URL: https://datasheet.ciiva.com/46445/444357-46445718.pdf?src-supplier=Element14; ComponentLink5Description: https://datasheet.ciiva.com/46445/444357-46445718.pdf?src-supplier=Element14; ComponentLink6URL: https://datasheet.ciiva.com/17422/pyu-rc1206-51-rohs-l-4-17422460.pdf?src-supplier=Future+Electronics; ComponentLink6Description: https://datasheet.ciiva.com/17422/pyu-rc1206-51-rohs-l-4-17422460.pdf?src-supplier=Future+Electronics; Supplier 2: Rs; Stock 2: 2900; Pricing 2: 100=0,012, 1000=0,007, 2500=0,005, 5000=0,005, 10000=0,005 (GBP); Supplier 3: Avnet; Stock 3: 8860; Pricing 3: 1=0,104, 25=0,026, 50=0,021, 100=0,016 (USD); Supplier 4: Arrow Electronics; Stock 4: 830000; Pricing 4: 5000=0,0058, 10000=0,005, 25000=0,005, 50000=0,0037, 125000=0,0036 (USD); Supplier 5: Digikey; Stock 5: 2188492; Pricing 5: 1=0,1, 10=0,026, 50=0,0204, 100=0,0153, 500=0,01276, 1000=0,0102 (USD); Supplier 6: Mouser; Stock 6: 54929; Pricing 6: 1=0,1, 10=0,018, 50=0,018, 100=0,015, 1000=0,009, 10000=0,005 (USD); Supplier Part Number 1: 8645095; Supplier Part Number 6: 603-RC1206FR-07680RL; Supplier Part Number 2: 1988442; Supplier Part Number 3: 49AK3834; Supplier Part Number 4: RC1206FR-07680RL; Supplier Part Number 5: 311-680FRCT-ND
U1 = TPS54331DR: 3.5V to 28V Input, 3A, 570kHz Step-Down Converter with Eco-mode 8-SOIC -40 to 150; Manufacturer: Texas Instruments; Output Voltage: 25V; Number of Outputs: 1; Min Output Voltage: 800mV; Synchronous Rectifier: No; Quiescent Current: 110uA; Output Type: Adjustable; Output Configuration: Positive; Number of Channels: 1NUMBER; DesignedBy: Aslı Kurt; Supplier 1: Digikey; Manufacturer Part Number: TPS54331DR; RoHS: Yes; Category: Voltage Regulators - Switching; Stock 1: 4154; Pricing 1: 1=1,87, 10=1,322, 25=1,1864, 100=1,0368, 250=0,96548, 500=0,92248, 1000=0,88708 (USD); Case/Package: D; Number of Pins: 8; Weight: 0.002561oz; Min Operating Temperature: -40°C; Max Operating Temperature: 150°C; Output Current: 3A; Packaging: Tape and Reel; Package Quantity: 1; Switching Frequency: 570kHz; Max Output Current: 3A; Max Input Voltage: 28V; Min Input Voltage: 3.5V; Max Output Voltage: 25V; Operating Supply Voltage: 28V; Series: Eco-Mode™; Length: 5mm; Width: 4mm; Height: 1.5mm; Thickness: 1.58mm; Radiation Hardening: No; Lead Free: Lead Free; RoHS Compliant: Yes; Reach SVHC Compliant: No; ComponentLink1URL: https://datasheet.ciiva.com/41462/001014850-da-01-en-ic-reg-buck-adj-3a-tps54331dr-soic-8-tid-41462698.pdf?src-supplier=Conrad; ComponentLink1Description: https://datasheet.ciiva.com/41462/001014850-da-01-en-ic-reg-buck-adj-3a-tps54331dr-soic-8-tid-41462698.pdf?src-supplier=Conrad; ComponentLink2URL: https://datasheet.ciiva.com/2034/tps54331-2034841.pdf?src-supplier=Digikey; ComponentLink2Description: https://datasheet.ciiva.com/2034/tps54331-2034841.pdf?src-supplier=Digikey; ComponentLink3URL: https://datasheet.ciiva.com/2034/tps54331-2034840.pdf?src-supplier=Digikey; ComponentLink3Description: https://datasheet.ciiva.com/2034/tps54331-2034840.pdf?src-supplier=Digikey; ComponentLink4URL: https://datasheet.ciiva.com/2034/tps54331-2034842.pdf?src-supplier=Digikey; ComponentLink4Description: https://datasheet.ciiva.com/2034/tps54331-2034842.pdf?src-supplier=Digikey; ComponentLink5URL: https://datasheet.ciiva.com/14303/tps54331-14303672.pdf?src-supplier=Avnet; ComponentLink5Description: https://datasheet.ciiva.com/14303/tps54331-14303672.pdf?src-supplier=Avnet; Supplier Part Number 1: 296-26991-6-ND